# Altium schematic sheet 原理图.SchDoc
size A4
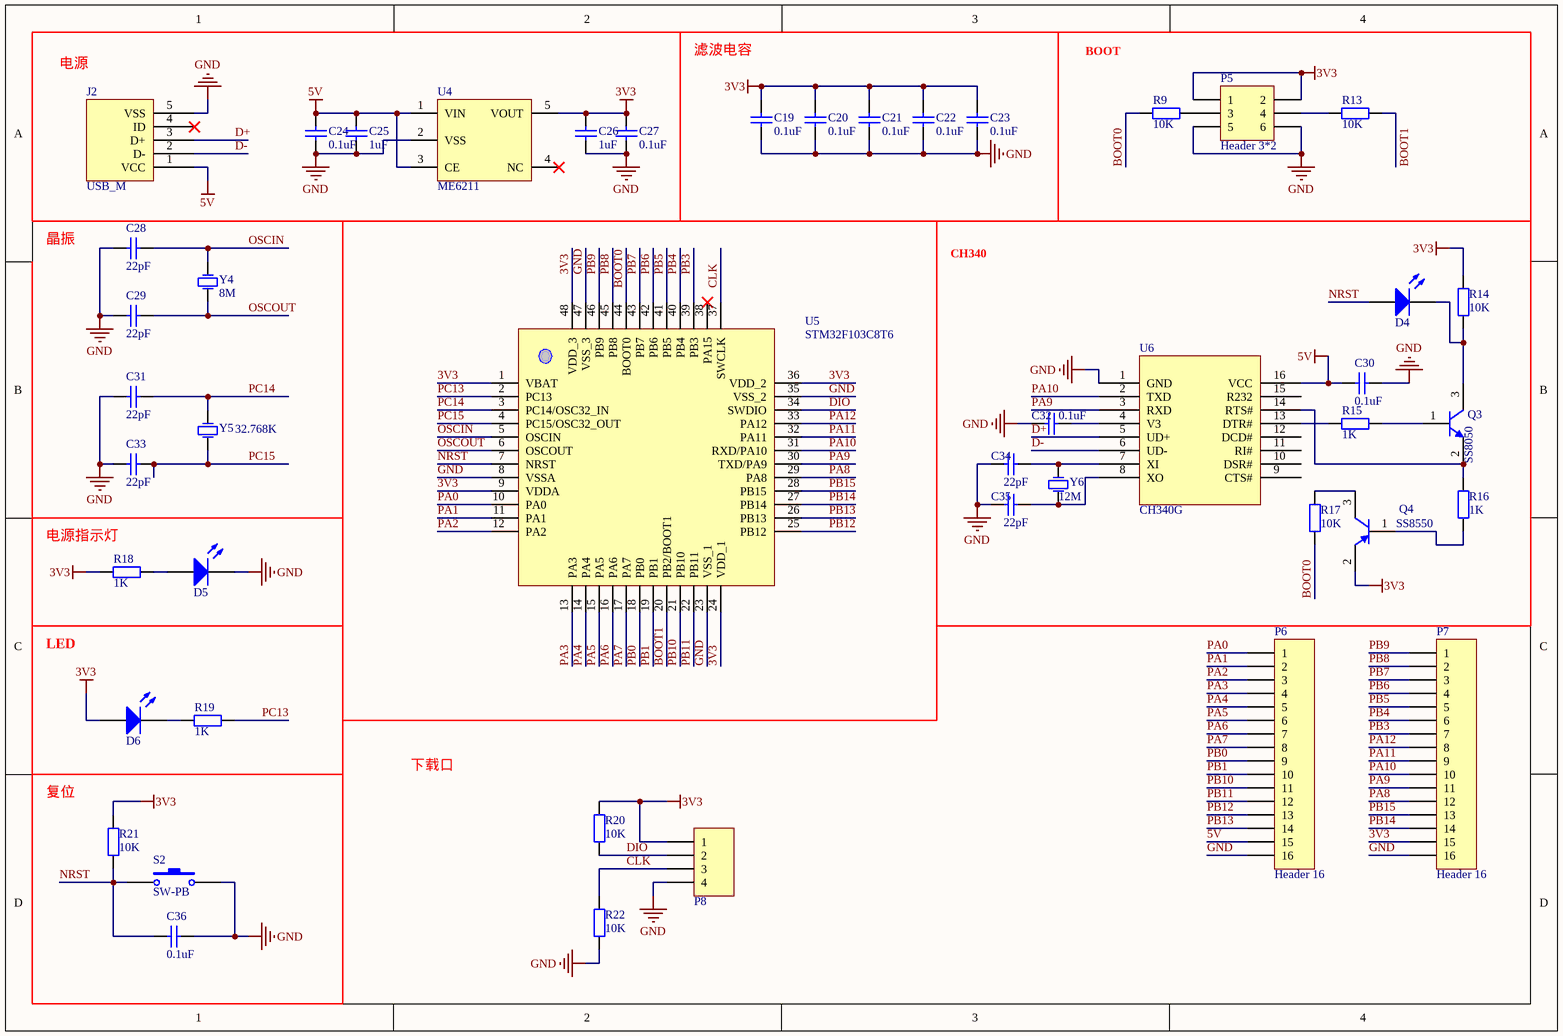
[diagram p0: 原理图.SchDoc]

## Parts
C19  value 0.1uF  [0603_C]  (hidden comment: Cap)
C20  value 0.1uF  [0603_C]  (hidden comment: Cap)
C21  value 0.1uF  [0603_C]  (hidden comment: Cap)
C22  value 0.1uF  [0603_C]  (hidden comment: Cap)
C23  value 0.1uF  [0603_C]  (hidden comment: Cap)
C24  value 0.1uF  [0603_C]  (hidden comment: Cap)
C25  value 1uF  [0603_C]  (hidden comment: Cap)
C26  value 1uF  [0603_C]  (hidden comment: Cap)
C27  value 0.1uF  [0603_C]  (hidden comment: Cap)
C28  value 22pF  [0603_C]  (hidden comment: Cap)
C29  value 22pF  [0603_C]  (hidden comment: Cap)
C30  value 0.1uF  [0603_C]  (hidden comment: Cap)
C31  value 22pF  [0603_C]  (hidden comment: Cap)
C32  value 0.1uF  [0603_C]  (hidden comment: Cap)
C33  value 22pF  [0603_C]  (hidden comment: Cap)
C34  value 22pF  [0603_C]  (hidden comment: Cap)
C35  value 22pF  [0603_C]  (hidden comment: Cap)
C36  value 0.1uF  [0603_C]  (hidden comment: Cap)
D4  LED0  [LED_0805_Blue]  (value not drawn)
D5  LED0  [LED_0805_Blue]  (value not drawn)
D6  LED0  [LED_0805_Blue]  (value not drawn)
J2  USB_M  [USB]
P5  Header 3*2  [HDR3X2]
P6  Header 16  [HDR16X1_A]
P7  Header 16  [HDR16X1_A]
P8  Header 4  [HDR4X1_A]  (value not drawn)
Q3  SS8050  [SOT-23]
Q4  SS8550  [SOT-23]
R9  value 10K  [0603_R]  (hidden comment: Res1)
R13  value 10K  [0603_R]  (hidden comment: Res1)
R14  value 10K  [0603_R]  (hidden comment: Res1)
R15  value 1K  [0603_R]  (hidden comment: Res1)
R16  value 1K  [0603_R]  (hidden comment: Res1)
R17  value 10K  [0603_R]  (hidden comment: Res1)
R18  value 1K  [0603_R]  (hidden comment: Res1)
R19  value 1K  [0603_R]  (hidden comment: Res1)
R20  value 10K  [0603_R]  (hidden comment: Res1)
R21  value 10K  [0603_R]  (hidden comment: Res1)
R22  value 10K  [0603_R]  (hidden comment: Res1)
S2  SW-PB  [SW_PB2_A1]
U4  ME6211  [SOT23-5]
U5  STM32F103C8T6  [LQFP-48_M]
U6  CH340G  [SOP-16]
Y4  8M  [5032]
Y5  32.768K  [3215]
Y6  12M  [5032]

## Blocks framed on the sheet
电源: C24-C27 J2 U4

## Nets
3V3: C19.2 C20.2 C21.2 C22.2 C23.2 C26.2 C27.2 D6.1(A) P5.1 P5.2 P7.15 P8.1 Q4.2(E) R14.2 R18.1 R20.2 R21.2 U4.5(VOUT) U5.1(VBAT) U5.9(VDDA) U5.24(VDD_1) U5.36(VDD_2) U5.48(VDD_3)
5V: C24.2 C25.2 C30.1 J2.1(VCC) P6.15 U4.1(VIN) U4.3(CE) U6.16(VCC)
GND: C19.1 C20.1 C21.1 C22.1 C23.1 C24.1 C25.1 C26.1 C27.1 C28.2 C29.2 C30.2 C31.2 C32.1 C33.2 C34.2 C35.2 C36.2 D5.2(K) J2.5(VSS) P5.5 P5.6 P6.16 P7.16 P8.4 R22.1 S2.2 U4.2(VSS) U5.8(VSSA) U5.23(VSS_1) U5.35(VSS_2) U5.47(VSS_3) U6.1(GND)
BOOT0: R9.1 R17.1 U5.44(BOOT0)
BOOT1: R13.2 U5.20(PB2/BOOT1)
CLK: P8.3 R22.2 U5.37(SWCLK)
D+: J2.3(D+) U6.5(UD+)
D-: J2.2(D-) U6.6(UD-)
DIO: P8.2 R20.1 U5.34(SWDIO)
NRST: C36.1 D4.1(A) R21.1 S2.1 U5.7(NRST)
OSCIN: C28.1 U5.5(OSCIN) Y4.1(OSC1)
OSCOUT: C29.1 U5.6(OSCOUT) Y4.2(OSC2)
PA0: P6.1 U5.10(PA0)
PA1: P6.2 U5.11(PA1)
PA2: P6.3 U5.12(PA2)
PA3: P6.4 U5.13(PA3)
PA4: P6.5 U5.14(PA4)
PA5: P6.6 U5.15(PA5)
PA6: P6.7 U5.16(PA6)
PA7: P6.8 U5.17(PA7)
PA8: P7.12 U5.29(PA8)
PA9: P7.11 U5.30(TXD/PA9) U6.3(RXD)
PA10: P7.10 U5.31(RXD/PA10) U6.2(TXD)
PA11: P7.9 U5.32(PA11)
PA12: P7.8 U5.33(PA12)
PB0: P6.9 U5.18(PB0)
PB1: P6.10 U5.19(PB1)
PB3: P7.7 U5.39(PB3)
PB4: P7.6 U5.40(PB4)
PB5: P7.5 U5.41(PB5)
PB6: P7.4 U5.42(PB6)
PB7: P7.3 U5.43(PB7)
PB8: P7.2 U5.45(PB8)
PB9: P7.1 U5.46(PB9)
PB10: P6.11 U5.21(PB10)
PB11: P6.12 U5.22(PB11)
PB12: P6.13 U5.25(PB12)
PB13: P6.14 U5.26(PB13)
PB14: P7.14 U5.27(PB14)
PB15: P7.13 U5.28(PB15)
PC13: R19.2 U5.2(PC13)
PC14: C31.1 U5.3(PC14/OSC32_IN) Y5.1(OSC1)
PC15: C33.1 U5.4(PC15/OSC32_OUT) Y5.2(OSC2)
NetC32_2: C32.2 U6.4(V3)
NetC34_1: C34.1 U6.7(XI) Y6.1(OSC1)
NetC35_1: C35.1 U6.8(XO) Y6.2(OSC2)
NetD4_2: D4.2(K) Q3.3(C) R14.1
NetD5_1: D5.1(A) R18.2
NetD6_2: D6.2(K) R19.1
NetP5_3: P5.3 R9.2
NetP5_4: P5.4 R13.1
NetQ3_1: Q3.1(B) R15.2
NetQ3_2: Q3.2(E) R16.2 U6.14(RTS#)
NetQ4_1: Q4.1(B) R16.1
NetQ4_3: Q4.3(C) R17.2
NetR15_1: R15.1 U6.13(DTR#)

Not connected (* = marked no-connect by the designer): J2 4(ID)*; U4 4(NC)*; U5 38(PA15)*; U6 9(CTS#) 10(DSR#) 11(RI#) 12(DCD#) 15(R232)

## Notes on the sheet
- 滤波电容
- BOOT
- 晶振
- CH340
- (near R18) 电源指示灯
- LED
- 下载口
- 复位

## Library data of the parts
C19-C36 = Cap: 无极性电容; Published: 8-Jun-2000; LatestRevisionDate: 17-Jul-2002; LatestRevisionNote: Re-released for DXP Platform.; PackageReference: RAD-0.3; Publisher: Altium Limited
D4-D6 = LED0: 发光二极管; Published: 8-Jun-2000; LatestRevisionDate: 08-Jul-2005; LatestRevisionNote: Mech Layer 1 removed.; PackageReference: LED-0; Publisher: Altium Limited
J2 = USB_M: MicroUSB接口
P5 = Header 3*2: 接插件
P6 P7 = Header 16: Header16贴片; LatestRevisionDate: 17-Jul-2002; LatestRevisionNote: Re-released for DXP Platform.; Publisher: Altium Limited
P8 = Header 4: 接插件; LatestRevisionDate: 17-Jul-2002; LatestRevisionNote: Re-released for DXP Platform.; Publisher: Altium Limited
Q3 = SS8050: NPN贴片三极管; Published: 8-Jun-2000; LatestRevisionDate: 15-Jan-2003; LatestRevisionNote: PCB Footprint 'BCY-W3/D4.7' replaced; DatasheetDocument: 1997; PackageDocument: Sep-1998; PackageReference: TO-92A; Publisher: Altium Limited; Code_JEDEC: TO-92A; ComponentLink1Description: Manufacturer Link; ComponentLink1URL: http://www.fairchildsemi.com/; ComponentLink2Description: Datasheet; ComponentLink2URL: http://www.fairchildsemi.com/ds/2N%2F2N3904.pdf
Q4 = SS8550: PNP贴片三极管; Published: 8-Jun-2000; LatestRevisionDate: 15-Jan-2003; LatestRevisionNote: PCB Footprint 'BCY-W3/D4.7' replaced; DatasheetDocument: 1997; PackageDocument: Sep-1998; PackageReference: TO-92A; Publisher: Altium Limited; Code_JEDEC: TO-92A; ComponentLink1Description: Manufacturer Link; ComponentLink1URL: http://www.fairchildsemi.com/; ComponentLink2Description: Datasheet; ComponentLink2URL: http://www.fairchildsemi.com/ds/2N%2F2N3906.pdf
R9 R13-R22 = Res1: 贴片电阻; Published: 8-Jun-2000; LatestRevisionDate: 17-Jul-2002; LatestRevisionNote: Re-released for DXP Platform.; PackageReference: AXIAL-0.4; Publisher: Altium Limited
S2 = SW-PB: 微动开关; Published: 24-Mar-1999; LatestRevisionDate: 17-Jul-2002; LatestRevisionNote: Re-released for DXP Platform.; PackageReference: SPST-2; Publisher: Altium Limited
U5 = STM32F103C8T6: STM32单片机48引脚
U6 = CH340G: 串口芯片
Y4-Y6 = XTAL: 晶振; Published: 8-Jun-2000; LatestRevisionDate: 17-Jul-2002; LatestRevisionNote: Re-released for DXP Platform.; PackageReference: R38; Publisher: Altium Limited